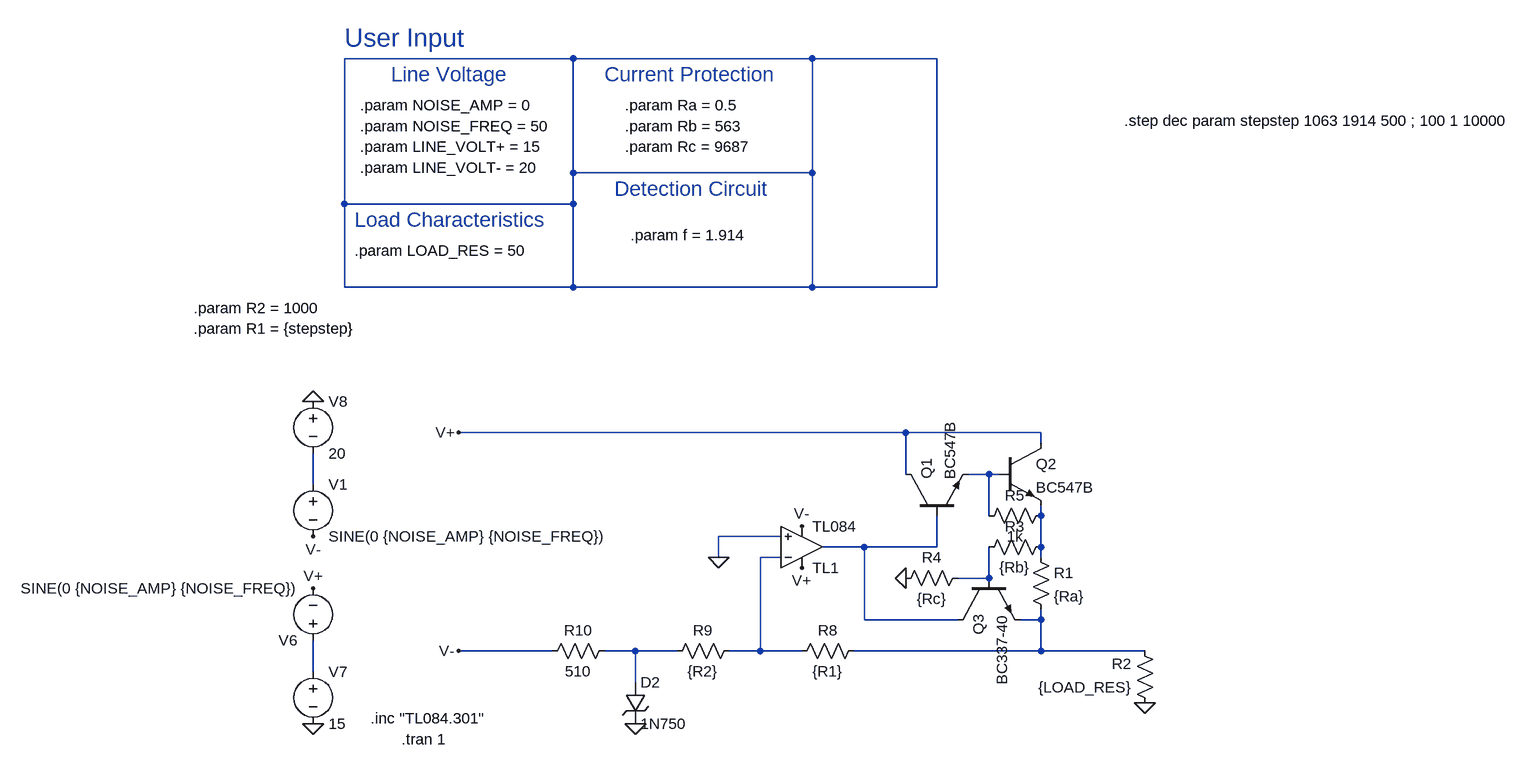
[diagram p0: schematic lolnuevofolbak.asc]
lolnuevofolbak.asc, the LTspice schematic file:
Version 4
SHEET 1 1876 680
WIRE -416 -1472 -768 -1472
WIRE -48 -1472 -416 -1472
WIRE 144 -1472 -48 -1472
WIRE -416 -1296 -416 -1472
WIRE -48 -1296 -48 -1472
WIRE -48 -1296 -416 -1296
WIRE -768 -1248 -768 -1472
WIRE -416 -1248 -416 -1296
WIRE -416 -1248 -768 -1248
WIRE -768 -1120 -768 -1248
WIRE -416 -1120 -416 -1248
WIRE -416 -1120 -768 -1120
WIRE -48 -1120 -48 -1296
WIRE -48 -1120 -416 -1120
WIRE 144 -1120 144 -1472
WIRE 144 -1120 -48 -1120
WIRE 96 -896 -592 -896
WIRE 304 -896 96 -896
WIRE 304 -880 304 -896
WIRE 96 -832 96 -896
WIRE 224 -832 192 -832
WIRE 240 -832 224 -832
WIRE -816 -816 -816 -864
WIRE 224 -768 224 -832
WIRE 304 -768 304 -784
WIRE -96 -736 -192 -736
WIRE 32 -720 -32 -720
WIRE 144 -720 144 -768
WIRE 144 -720 32 -720
WIRE 304 -720 304 -768
WIRE -192 -704 -192 -736
WIRE -96 -704 -128 -704
WIRE 304 -704 304 -720
WIRE 224 -672 224 -720
WIRE 224 -672 176 -672
WIRE 32 -608 32 -720
WIRE 176 -608 32 -608
WIRE 304 -608 304 -624
WIRE 304 -608 272 -608
WIRE -448 -560 -592 -560
WIRE -320 -560 -368 -560
WIRE -256 -560 -320 -560
WIRE -128 -560 -128 -704
WIRE -128 -560 -176 -560
WIRE -64 -560 -128 -560
WIRE 304 -560 304 -608
WIRE 304 -560 16 -560
WIRE 464 -560 304 -560
WIRE -816 -528 -816 -576
WIRE -320 -512 -320 -560
FLAG -320 -448 0
FLAG -64 -688 V+
FLAG -64 -752 V-
FLAG -816 -656 V+
FLAG -816 -944 0
FLAG -816 -736 V-
FLAG -816 -448 0
FLAG -592 -560 V-
FLAG -592 -896 V+
FLAG 464 -480 0
FLAG 96 -672 0
FLAG -192 -704 0
SYMBOL Opamps\\opamp2 -64 -656 M180
SYMATTR InstName TL1
SYMATTR Value TL084
SYMBOL res 32 -576 R90
WINDOW 0 0 56 VBottom 2
WINDOW 3 32 56 VTop 2
SYMATTR InstName R8
SYMATTR Value {R1}
SYMBOL res -160 -576 R90
WINDOW 0 0 56 VBottom 2
WINDOW 3 32 56 VTop 2
SYMATTR InstName R9
SYMATTR Value {R2}
SYMBOL res -352 -576 R90
WINDOW 0 0 56 VBottom 2
WINDOW 3 32 56 VTop 2
SYMATTR InstName R10
SYMATTR Value 510
SYMBOL zener -336 -512 R0
SYMATTR InstName D2
SYMATTR Value 1N750
SYMBOL voltage -816 -832 R0
WINDOW 123 0 0 Left 0
WINDOW 39 0 0 Left 0
SYMATTR InstName V1
SYMATTR Value SINE(0 {NOISE_AMP} {NOISE_FREQ})
SYMBOL voltage -816 -560 R180
WINDOW 123 0 0 Left 0
WINDOW 39 0 0 Left 0
SYMATTR InstName V6
SYMATTR Value SINE(0 {NOISE_AMP} {NOISE_FREQ})
SYMBOL voltage -816 -544 R0
WINDOW 123 0 0 Left 0
WINDOW 39 0 0 Left 0
SYMATTR InstName V7
SYMATTR Value 15
SYMBOL voltage -816 -960 R0
WINDOW 123 0 0 Left 0
WINDOW 39 0 0 Left 0
SYMATTR InstName V8
SYMATTR Value 20
SYMBOL npn 240 -880 R0
SYMATTR InstName Q2
SYMATTR Value BC547B
SYMBOL npn 96 -768 R270
SYMATTR InstName Q1
SYMATTR Value BC547B
SYMBOL npn 176 -672 M90
SYMATTR InstName Q3
SYMATTR Value BC337-40
SYMBOL res 288 -720 R0
SYMATTR InstName R1
SYMATTR Value {Ra}
SYMBOL res 480 -464 R180
WINDOW 0 36 76 Left 2
WINDOW 3 36 40 Left 2
SYMATTR InstName R2
SYMATTR Value {LOAD_RES}
SYMBOL res 320 -736 R90
WINDOW 0 0 56 VBottom 2
WINDOW 3 32 56 VTop 2
SYMATTR InstName R3
SYMATTR Value {Rb}
SYMBOL res 192 -688 R90
WINDOW 0 0 56 VBottom 2
WINDOW 3 32 56 VTop 2
SYMATTR InstName R4
SYMATTR Value {Rc}
SYMBOL res 320 -784 R90
WINDOW 0 0 56 VBottom 2
WINDOW 3 32 56 VTop 2
SYMATTR InstName R5
SYMATTR Value 1k
TEXT -680 -424 Left 2 !.tran 1
TEXT -728 -456 Left 2 !.inc "TL084.301"
TEXT -744 -1400 Left 2 !.param NOISE_AMP = 0
TEXT -744 -1368 Left 2 !.param NOISE_FREQ = 50
TEXT -768 -1504 Left 4 ;User Input
TEXT -696 -1448 Left 3 ;Line Voltage
TEXT -744 -1336 Left 2 !.param LINE_VOLT+ = 15
TEXT -744 -1304 Left 2 !.param LINE_VOLT- = 20
TEXT -752 -1224 Left 3 ;Load Characteristics
TEXT -752 -1176 Left 2 !.param LOAD_RES = 50
TEXT -368 -1448 Left 3 ;Current Protection
TEXT -336 -1400 Left 2 !.param Ra = 0.5
TEXT -336 -1368 Left 2 !.param Rb = 563
TEXT 432 -1376 Left 2 !.step dec param stepstep 1063 1914 500 ; 100 1 10000
TEXT -336 -1336 Left 2 !.param Rc = 9687
TEXT -352 -1272 Left 3 ;Detection Circuit
TEXT -328 -1200 Left 2 !.param f = 1.914
TEXT -1000 -1088 Left 2 !.param R2 = 1000
TEXT -1000 -1056 Left 2 !.param R1 = {stepstep}

The netlist it stands for:
* lolnuevofolbak.asc
XTL1 0 N006 V+ V- N005 TL084  ; pins In+ In- V+ V- OUT
R8 N008 N006 {R1}
R9 N006 N009 {R2}
R10 N009 V- 510
D2 N009 0 1N750
V1 N003 V- SINE(0 {NOISE_AMP} {NOISE_FREQ})
V6 N010 V+ SINE(0 {NOISE_AMP} {NOISE_FREQ})
V7 N010 0 15
V8 0 N003 20
Q2 V+ N002 N004 0 BC547B
Q1 V+ N005 N002 0 BC547B
Q3 N005 N007 N008 0 BC337-40
R1 N004 N008 {Ra}
R2 0 N008 {LOAD_RES}
R3 N004 N007 {Rb}
R4 N007 0 {Rc}
R5 N004 N002 1k
.model D D
.lib standard.dio
.model NPN NPN
.model PNP PNP
.lib standard.bjt
.tran 1
.inc "TL084.301"
.param NOISE_AMP = 0
.param NOISE_FREQ = 50
* User Input
* Line Voltage
.param LINE_VOLT+ = 15
.param LINE_VOLT- = 20
* Load Characteristics
.param LOAD_RES = 50
* Current Protection
.param Ra = 0.5
.param Rb = 563
.step dec param stepstep 1063 1914 500 ; 100 1 10000
.param Rc = 9687
* Detection Circuit
.param f = 1.914
.param R2 = 1000
.param R1 = {stepstep}
.backanno
.end